# Altium project 20K Control Board V1.1.PrjPCB (part 6 of 6)
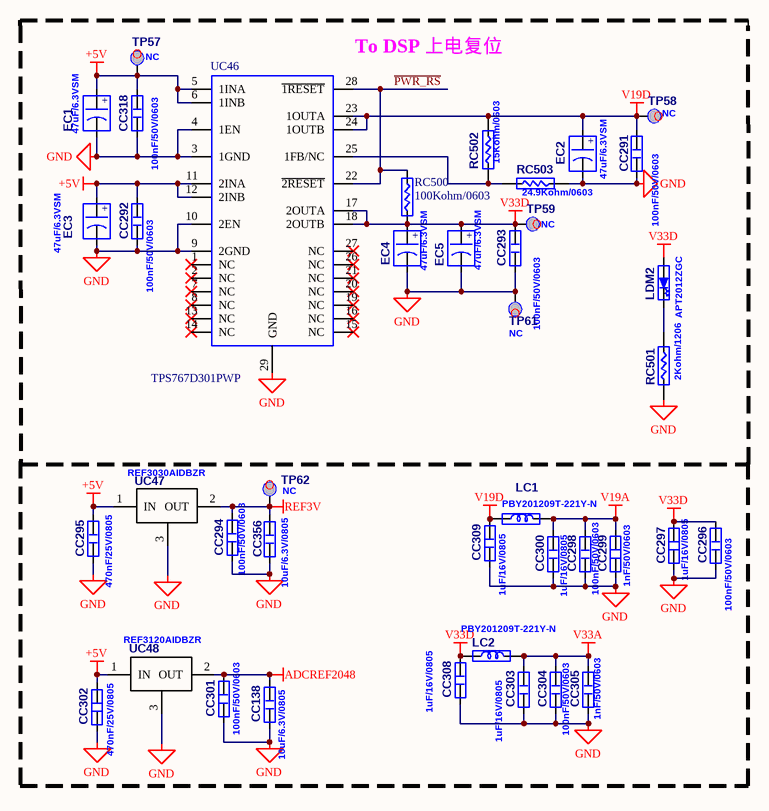
[diagram p12: Power.SchDoc]

## Nets that join several sheets
50mA.ON: CPU M (RC238.1 UC601.4), IO (CNC10.8)
#MDSP_OK: CPU-S (RC664.1), CPU M (RC204.1 RC205.2 TP25.1 UC19.3)
#SDSP_OK: CPU-S (RC504.1 RC599.2 UC65.3), CPU M (RC280.1)
+5V: CPU-S (27 pins), DC SPS (+5V.1 RA111.1), Driver (33 pins), AD (5 pins), CPU M (15 pins), IO (15 pins), Power (13 pins)
+5V_COM: CPU-S (10 pins), DC SPS (5 pins)
+12V: DC SPS (9 pins), Driver (78 pins), AD (30 pins), IO (17 pins)
-12V: DC SPS (-12V.1 CNA1.3 LA7.2), AD (22 pins), IO (10 pins)
ADCREF2048: CPU M (CC147.2 UC20.54), Power (CC138.2 CC301.1 UC48.2)
AUX.SHUT: DC SPS (CA121.2 CA122.2 RA187.1), Driver (CC248.2 CC249.2 CC349.2 RC381.1)
AUX_OK: Driver (DC32.1 RC337.1), CPU M (UC20.128)
BO1QN_A: Driver (QC18.2 QC21.2), IO (CND7.40)
BO1QP_A: Driver (QC6.2 QC10.2), IO (CND7.36)
BO1QP_K: Driver (RC354.2), IO (CND7.35)
BO2QN_A: Driver (QC34.2 QC37.2), IO (CND7.39)
BO2QP_A: Driver (QC26.2 QC27.2), IO (CND7.38)
BO2QP_K: Driver (RC379.2), IO (CND7.37)
DSP_OUTOCP: AD (UC50.3 UC50.5 UC50.9), CPU M (CC136.2 UC20.21)
FAN5V.STATE1: CPU-S (CNC25.5), DC SPS (DC7.1 RC81.2)
FAN5V.STATE2: CPU-S (CNC25.7), DC SPS (DC8.1 RC82.2)
FAN5V.STATE3: CPU-S (CNC25.1), DC SPS (DC30.1 RC85.2)
FAN.CONTROL: CPU-S (CNC25.3), DC SPS (RC78.2)
GFCI: AD (RC163.1 RC174.1), IO (CNC10.7)
GND: CPU-S (116 pins), DC SPS (26 pins), Driver (216 pins), AD (126 pins), CPU M (189 pins), IO (72 pins), Power (35 pins)
GND_S: CPU-S (23 pins), DC SPS (23 pins)
IgridR: AD (RC18.1), CPU M (DC16.3 RC228.1)
IgridS: AD (RC91.1), CPU M (DC17.3 RC229.1)
IgridT: AD (RC16.1), CPU M (DC15.3 RC230.1)
INVAQ1_A: Driver (QC8.2 QC12.2), IO (CND7.17)
INVAQ1_K: Driver (RC356.2), IO (CND7.18)
INVAQ2_A: Driver (QC16.2 QC20.2), IO (CND7.13)
INVAQ2_K: Driver (RC368.2), IO (CND7.14)
INVAQ3_A: Driver (QC24.2 QC29.2), IO (CND7.15)
INVAQ3_K: Driver (RC377.2), IO (CND7.16)
INVAQ4_A: Driver (QC32.2 QC36.2), IO (CND7.11)
INVAQ4_K: Driver (RC388.2), IO (CND7.12)
INVBQ1_A: Driver (QC7.2 QC11.2), IO (CND7.21)
INVBQ1_K: Driver (RC355.2), IO (CND7.22)
INVBQ2_A: Driver (QC15.2 QC19.2), IO (CND7.23)
INVBQ2_K: Driver (RC367.2), IO (CND7.24)
INVBQ3_A: Driver (QC23.2 QC28.2), IO (CND7.19)
INVBQ3_K: Driver (RC376.2), IO (CND7.20)
INVBQ4_A: Driver (QC31.2 QC35.2), IO (CND7.25)
INVBQ4_K: Driver (RC387.2), IO (CND7.26)
INVCQ1_A: Driver (QC9.2 QC13.2), IO (CND7.27)
INVCQ1_K: Driver (RC357.2), IO (CND7.28)
INVCQ2_A: Driver (QC17.2 QC22.2), IO (CND7.33)
INVCQ2_K: Driver (RC370.2), IO (CND7.34)
INVCQ3_A: Driver (QC25.2 QC30.2), IO (CND7.29)
INVCQ3_K: Driver (RC378.2), IO (CND7.30)
INVCQ4_A: Driver (QC33.2 QC38.2), IO (CND7.31)
INVCQ4_K: Driver (RC389.2), IO (CND7.32)
Ipv1: AD (CC446.1 UC634.1 UC634.2), CPU M (DC23.3 RC264.1)
Ipv1+: AD (RC57.2), IO (CNC6.1)
Ipv1-: AD (RC69.2), IO (CNC6.2)
Ipv2: AD (CC448.1 UC634.13 UC634.14), CPU M (DC24.3 RC265.1)
Ipv2+: AD (RC76.2), IO (CNC6.3)
Ipv2-: AD (RC87.2), IO (CNC6.4)
M.DCI-R/S/T: AD (RC166.2), CPU M (DC18.3 RC240.1)
M.GFCI: AD (RC171.2 TP20.1), CPU M (DC19.3 RC241.1)
M.VgridR: AD (RC14.2), CPU M (DC12.3 RC218.1)
M.VgridS: AD (RC72.2), CPU M (DC13.3 RC219.1)
M.VgridT: AD (RC128.2), CPU M (DC14.3 RC220.1)
M.Vpv1: AD (RC4.2), CPU M (DC21.3 RC255.1)
M.Vpv2: AD (RC33.2), CPU M (DC20.3 RC256.1)
OUTOCP: Driver (RC518.1 RC519.1), IO (QC43.3 RC498.2)
REF3V: CPU-S (CC437.1 UC73.19), AD (8 pins), Power (CC294.1 CC356.2 TP62.1 UC47.2)
S.DCI-R: CPU-S (DC67.3 RC655.1), AD (RC56.1)
S.DCI-S: CPU-S (DC65.3 RC656.1), AD (RC137.1)
S.DCI-T: CPU-S (DC66.3 RC657.1), AD (RC55.1)
S.GFCI: CPU-S (DC68.3 RC668.1), AD (RC175.2)
S.RL-PVISO1: CPU-S (RC674.1 UC605.6), IO (CNC6.9)
S.RL-PVISO2: CPU-S (RC680.2 UC605.4), IO (CNC6.10)
S.Temp-Boost/Amb: CPU-S (DC69.3 RC666.1), AD (RC187.1)
S.Temp-INV: CPU-S (DC70.3 RC667.1), AD (RC189.2)
S.V-INV-R: CPU-S (DC60.3 RC631.1), AD (RC168.2 RC169.1)
S.V-INV-S: CPU-S (DC59.3 RC632.1), AD (RC181.2 RC184.1)
S.V-INV-T: CPU-S (DC61.3 RC633.1), AD (RC200.2 RC201.1)
S.VgridR: CPU-S (DC63.3 RC644.1), AD (RC3.2)
S.VgridS: CPU-S (DC62.3 RC645.1), AD (RC65.2)
S.VgridT: CPU-S (DC64.3 RC646.1), AD (RC111.2)
S.Viso-PV1: CPU-S (DC56.3 RC616.1), AD (RC183.2 TP24.1)
S.Vpv1: CPU-S (DC54.3 RC596.1), AD (RC11.2)
S.Vpv2: CPU-S (DC55.3 RC595.1), AD (RC39.2)
TempAmb: AD (UC16.12), IO (5 pins)
V19A: CPU M (CC157.2 CC160.2 UC20.31 UC20.59), Power (CC298.1 CC299.1 CC300.1 LC1.2)
V19D: CPU M (27 pins), Power (8 pins)
V33A: CPU-S (18 pins), CPU M (20 pins), Power (CC303.2 CC304.1 CC305.2 LC2.2)
V33D: CPU-S (22 pins), Driver (41 pins), AD (CC46.1 RC110.1 RC532.1 UC50.14), CPU M (44 pins), IO (7 pins), Power (12 pins)
VBus01: AD (RC118.1), IO (CND7.2)
VBus02: AD (RC145.1), IO (CND7.4)
VBus+: AD (RC104.1), IO (CND7.1)
VBus-: AD (RC151.1), IO (CND7.3)
VBusN: AD (RC146.1), CPU M (DC29.3 RC275.1)
VBusP: AD (RC105.1), CPU M (DC28.3 RC274.1)
Vpv1+: AD (RC2.2), IO (CNC6.5)
Vpv1-: AD (RC15.2), IO (CNC6.6)
Vpv2+: AD (RC32.2), IO (CNC6.8)
Vpv2-: AD (RC46.2), IO (CNC6.7)
12V-UVP: Driver (5 pins), IO (DC33.2 DC44.2)
#PV1-OCP: Driver (DC36.2 DC39.2), IO (5 pins)
#PV2-OCP: Driver (DC31.2 DC40.2), IO (5 pins)
BUSOVP/PVOCP_OFF: Driver (RC298.1 UC2.19), IO (QC42.3)
DSP_BusOVP: AD (5 pins), CPU M (CC140.2 UC20.26), IO (CC288.1 DC43.2)
DSP_PV1OCP: CPU M (CC137.2 UC20.24), IO (CC268.1 RC449.2 UC622.2)
DSP_PV2OCP: CPU M (CC139.2 UC20.25), IO (CC269.1 RC450.2 UC622.1)
IgridR+: AD (RC24.2), IO (CNC10.23)
IgridR-: AD (RC42.2), IO (CNC10.24)
IgridS+: AD (RC99.2), IO (CNC10.25)
IgridS-: AD (RC106.2), IO (CNC10.26)
IgridT+: AD (RC23.2), IO (CNC10.27)
IgridT-: AD (RC34.2), IO (CNC10.28)
Ipv1-P: AD (5 pins), IO (RC477.1)
Ipv2-P: AD (5 pins), IO (RC480.1)
LOCK: AD (CC48.1 RC535.2 UC50.10), CPU M (RC227.1 UC20.28)
M-232-RX: CPU-S (RC622.2 UC643.6), CPU M (UC20.67)
M-232-TX: CPU-S (RC660.2 UC643.1), CPU M (UC20.66)
M-SEL_A: AD (RC172.2), CPU M (RC245.1 UC601.8)
M-SEL_B: AD (RC176.2), CPU M (RC251.1 UC601.10)
M-SPICLK: CPU-S (RC677.2), CPU M (UC20.98)
M-SPISIMO: CPU-S (RC681.2), CPU M (UC20.96)
M-SPISTE: CPU-S (RC672.2), CPU M (UC20.99)
M.AUX.SHUT: Driver (DC37.1 RC148.2), CPU M (UC20.127)
M.RELY.CNTL: Driver (RC360.2), CPU M (RC254.1 UC601.6)
MCPUtoSCPU: CPU-S (RC661.1), CPU M (UC20.152)
OUTOCP1: Driver (6 pins), AD (UC50.8)
PV1_BOOST_DRi1: Driver (RC311.4 UC2.2), CPU M (UC20.68)
PV1_BOOST_DRi2: Driver (RC311.3 UC2.3), CPU M (UC20.72)
PV2_BOOST_DRi1: Driver (RC311.2 UC2.4), CPU M (UC20.69)
PV2_BOOST_DRi2: Driver (RC311.1 UC2.5), CPU M (UC20.73)
QA1_DRi_PWM: Driver (RC526.2 UC51.4), CPU M (UC20.5)
QA2_DRi_PWM: Driver (RC326.4 UC3.6), CPU M (UC20.10)
QA3_DRi_PWM: Driver (RC326.3 UC3.7), CPU M (UC20.6)
QA4_DRi_PWM: Driver (RC527.2 UC51.13), CPU M (UC20.7)
QB1_DRi_PWM: Driver (RC528.2 UC51.9), CPU M (UC20.11)
QB2_DRi_PWM: Driver (RC325.2 UC3.4), CPU M (UC20.16)
QB3_DRi_PWM: Driver (RC325.1 UC3.5), CPU M (UC20.12)
QB4_DRi_PWM: Driver (RC529.2 UC52.2), CPU M (UC20.13)
QC1_DRi_PWM: Driver (RC530.2 UC52.4), CPU M (UC20.17)
QC2_DRi_PWM: Driver (RC325.4 UC3.2), CPU M (UC20.20)
QC3_DRi_PWM: Driver (RC325.3 UC3.3), CPU M (UC20.18)
QC4_DRi_PWM: Driver (RC531.2 UC52.10), CPU M (UC20.19)
Relay-CTRL-R1: Driver (UC4.16), IO (CNC10.5)
Relay-CTRL-R2: Driver (UC4.17), IO (CNC10.6)
Relay-CTRL-S1: Driver (UC4.18), IO (CNC10.3)
Relay-CTRL-S2: Driver (UC4.19), IO (CNC10.4)
Relay-CTRL-T1: Driver (UC4.20), IO (CNC10.1)
Relay-CTRL-T2: Driver (UC4.21), IO (CNC10.2)
RESET-IN: AD (CC47.2 RC534.2 UC50.2), CPU M (RC225.2 UC20.27)
S-SEL_C: CPU-S (RC685.1 UC641.6), AD (RC196.2)
S-SEL_D: CPU-S (RC687.1 UC641.8), AD (RC197.2)
S-SPISOMI: CPU-S (UC73.76), CPU M (RC221.2)
S.AUX.SHUT: CPU-S (UC73.62), Driver (DC38.1 RC153.2)
S.Relay-R1: CPU-S (UC73.41), Driver (RC365.6 UC4.8)
S.Relay-R2: CPU-S (UC73.42), Driver (RC365.5 UC4.7)
S.Relay-S1: CPU-S (UC73.43), Driver (RC358.8 UC4.6)
S.Relay-S2: CPU-S (UC73.44), Driver (RC358.7 UC4.5)
S.Relay-T1: CPU-S (UC73.45), Driver (RC358.6 UC4.4)
S.Relay-T2: CPU-S (UC73.46), Driver (RC358.5 UC4.3)
S.~{XRS}: CPU-S (CC439.1 UC73.9), CPU M (CC169.2 DC26.1 RC269.1)
S_BOOST_OFF: CPU-S (UC73.63), Driver (RC296.1 UC2.1)
S_INV_OFF: CPU-S (UC73.64), Driver (RC290.1 RC314.2 UC1.1)
SCI_RX-FROM-PC: CPU-S (RC649.1 UC71.4), CPU M (RC233.1)
SCI_TX-TO-PC: CPU-S (RC642.2), CPU M (RC223.2 UC601.12)
SCPUtoMCPU: CPU-S (RC665.1), CPU M (UC20.153)
SYN AD with MCPU: CPU-S (TP68.1 UC73.33), CPU M (RC257.1)
TempBoost1: AD (UC16.15), IO (RC447.1)
TempBoost2: AD (UC16.14), IO (RC470.1)
TempINVR: AD (UC16.1), IO (RC478.1)
TempINVS: AD (UC16.2), IO (RC487.1)
TempINVT: AD (UC16.5), IO (RC496.1)
VgridR+: AD (RC6.2), IO (CNC10.40)
VgridR-: AD (RC19.1), IO (CNC10.39)
VgridS+: AD (RC67.2), IO (CNC10.36)
VgridS-: AD (RC73.1), IO (CNC10.35)
VgridT+: AD (RC116.2), IO (CNC10.32)
VgridT-: AD (RC132.1), IO (CNC10.31)
VinvR+: AD (RC167.1), IO (CNC10.38)
VinvR-: AD (RC177.1), IO (CNC10.37)
VinvS+: AD (RC180.1), IO (CNC10.34)
VinvS-: AD (RC191.1), IO (CNC10.33)
VinvT+: AD (RC199.1), IO (CNC10.30)
VinvT-: AD (RC202.1), IO (CNC10.29)
~{XRS}: CPU M (DC25.2 DC26.2 RC271.2 UC23.7), IO (CC287.1 DC41.2 DC42.2)